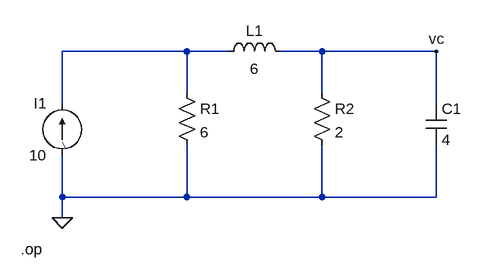
[diagram p0: schematic CH02-KP5-02.asc]
CH02-KP5-02.asc, the LTspice schematic file:
Version 4
SHEET 1 880 680
WIRE 368 208 176 208
WIRE 432 208 368 208
WIRE 576 208 512 208
WIRE 752 208 576 208
WIRE 368 272 368 208
WIRE 576 272 576 208
WIRE 176 288 176 208
WIRE 752 288 752 208
WIRE 176 432 176 368
WIRE 368 432 368 352
WIRE 368 432 176 432
WIRE 576 432 576 352
WIRE 576 432 368 432
WIRE 752 432 752 352
WIRE 752 432 576 432
WIRE 176 464 176 432
FLAG 176 464 0
FLAG 752 208 vc
DATAFLAG 624 208 "$"
SYMBOL res 352 256 R0
SYMATTR InstName R1
SYMATTR Value 6
SYMBOL res 560 256 R0
SYMATTR InstName R2
SYMATTR Value 2
SYMBOL ind 416 224 R270
WINDOW 0 32 56 VTop 2
WINDOW 3 5 56 VBottom 2
SYMATTR InstName L1
SYMATTR Value 6
SYMATTR SpiceLine Rser=0
SYMBOL cap 736 288 R0
SYMATTR InstName C1
SYMATTR Value 4
SYMBOL current 176 368 R180
WINDOW 0 24 80 Left 2
WINDOW 3 24 0 Left 2
SYMATTR InstName I1
SYMATTR Value 10
TEXT 112 512 Left 2 !.op
LINE Normal 176 348 180 356 2

The netlist it stands for:
* CH02-KP5-02.asc
R1 N001 0 6
R2 vc 0 2
L1 N001 vc 6 Rser=0
C1 vc 0 4
I1 0 N001 10
.op
.backanno
.end